# Altium schematic sheet 4_classyTKL_EC_analog.SchDoc: ClassyTKL - MX
size A4; Address1: github.com/4pplet/classytkl; Address2: Licence: CERN-OHL-S; Revision: A3; SheetNumber: 3; SheetTotal: 3
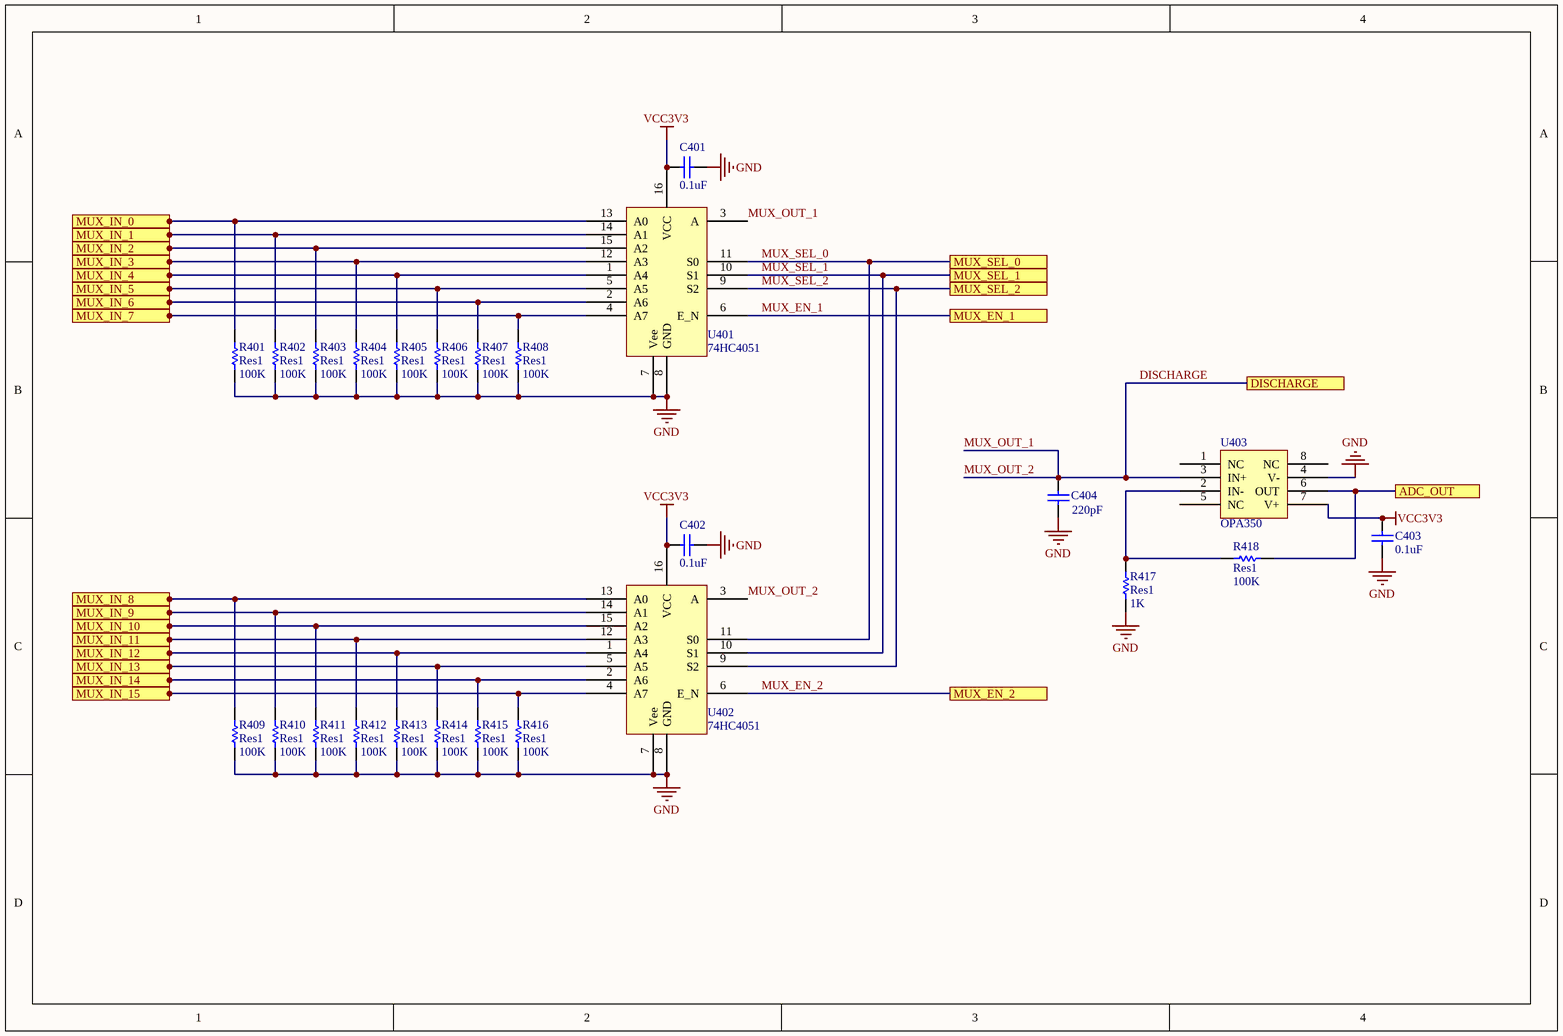
[diagram p0: 4_classyTKL_EC_analog.SchDoc]

## Parts
C401  value 0.1uF  [C0603[1608]]
C402  value 0.1uF  [C0603[1608]]
C403  value 0.1uF  [C0603[1608]]
C404  value 220pF  [C0603[1608]]
R401  Res1  value 100K  [R0603[1608]]
R402  Res1  value 100K  [R0603[1608]]
R403  Res1  value 100K  [R0603[1608]]
R404  Res1  value 100K  [R0603[1608]]
R405  Res1  value 100K  [R0603[1608]]
R406  Res1  value 100K  [R0603[1608]]
R407  Res1  value 100K  [R0603[1608]]
R408  Res1  value 100K  [R0603[1608]]
R409  Res1  value 100K  [R0603[1608]]
R410  Res1  value 100K  [R0603[1608]]
R411  Res1  value 100K  [R0603[1608]]
R412  Res1  value 100K  [R0603[1608]]
R413  Res1  value 100K  [R0603[1608]]
R414  Res1  value 100K  [R0603[1608]]
R415  Res1  value 100K  [R0603[1608]]
R416  Res1  value 100K  [R0603[1608]]
R417  Res1  value 1K  [R0603[1608]]
R418  Res1  value 100K  [R0603[1608]]
U401  74HC4051  [Texas_Instruments_D_SOIC16]
U402  74HC4051  [Texas_Instruments_D_SOIC16]
U403  OPA350  [SOIC-8]

## Ports
ADC_OUT, DISCHARGE, MUX_EN_1, MUX_EN_2, MUX_IN_0, MUX_IN_1, MUX_IN_2, MUX_IN_3, MUX_IN_4, MUX_IN_5, MUX_IN_6, MUX_IN_7, MUX_IN_8, MUX_IN_9, MUX_IN_10, MUX_IN_11, MUX_IN_12, MUX_IN_13, MUX_IN_14, MUX_IN_15, MUX_SEL_0, MUX_SEL_1, MUX_SEL_2

## Nets
GND: C401.1 C402.1 C403.2 C404.1 R401.2 R402.2 R403.2 R404.2 R405.2 R406.2 R407.2 R408.2 R409.2 R410.2 R411.2 R412.2 R413.2 R414.2 R415.2 R416.2 R417.2 U401.7(Vee) U401.8(GND) U402.7(Vee) U402.8(GND) U403.4(V-)
VCC3V3: C401.2 C402.2 C403.1 U401.16(VCC) U402.16(VCC) U403.7(V+)
ADC_OUT: R418.2 U403.6(OUT) ; port ADC_OUT
DISCHARGE: C404.2 U401.3(A) U402.3(A) U403.3(IN+) ; port DISCHARGE  [also labelled MUX_OUT_1, MUX_OUT_2]
MUX_EN_1: U401.6(E_N) ; port MUX_EN_1
MUX_EN_2: U402.6(E_N) ; port MUX_EN_2
MUX_IN_0: R401.1 U401.13(A0) ; port MUX_IN_0
MUX_IN_1: R402.1 U401.14(A1) ; port MUX_IN_1
MUX_IN_2: R403.1 U401.15(A2) ; port MUX_IN_2
MUX_IN_3: R404.1 U401.12(A3) ; port MUX_IN_3
MUX_IN_4: R405.1 U401.1(A4) ; port MUX_IN_4
MUX_IN_5: R406.1 U401.5(A5) ; port MUX_IN_5
MUX_IN_6: R407.1 U401.2(A6) ; port MUX_IN_6
MUX_IN_7: R408.1 U401.4(A7) ; port MUX_IN_7
MUX_IN_8: R409.1 U402.13(A0) ; port MUX_IN_8
MUX_IN_9: R410.1 U402.14(A1) ; port MUX_IN_9
MUX_IN_10: R411.1 U402.15(A2) ; port MUX_IN_10
MUX_IN_11: R412.1 U402.12(A3) ; port MUX_IN_11
MUX_IN_12: R413.1 U402.1(A4) ; port MUX_IN_12
MUX_IN_13: R414.1 U402.5(A5) ; port MUX_IN_13
MUX_IN_14: R415.1 U402.2(A6) ; port MUX_IN_14
MUX_IN_15: R416.1 U402.4(A7) ; port MUX_IN_15
MUX_SEL_0: U401.11(S0) U402.11(S0) ; port MUX_SEL_0
MUX_SEL_1: U401.10(S1) U402.10(S1) ; port MUX_SEL_1
MUX_SEL_2: U401.9(S2) U402.9(S2) ; port MUX_SEL_2
NetR417_1: R417.1 R418.1 U403.2(IN-)

Not connected (* = marked no-connect by the designer): U403 1(NC) 5(NC) 8(NC)

## Notes on the sheet
- Title
- Size:
- Date:
- A4
- Number:
- Time:
- Revision:
- Sheet
- of
- File:

## Library data of the parts
C401-C403 = Cap: Capacitor; MRF.Part: CC0603KRX7R9BB104; LCSC MFG: YAGEO; Version: 0603 imperial; LCSC Part #: C14663
C404 = Cap: Capacitor; MRF.Part: CL10B221KB8NNNC; LCSC MFG: Samsung Electro-Mechanics; Version: 0603 imperial; LCSC Part #: C1603
R401-R416 R418 = Res1: Resistor; MRF.Part: 0603WAF1003T5E; LCSC MFG: Uniroyal Elec; Version: 0603 imperial; LCSC Part #: C25803
R417 = Res1: Resistor; MRF.Part: 0603WAF1001T5E; LCSC MFG: UNI-ROYAL(Uniroyal Elec); Version: 0603 imperial; LCSC Part #: C21190
U401 U402 = 74HC4051: MRF.Part: 74HC4051D,653; LCSC MFG: Nexperia; LCSC Part #: C9386
U403 = OPA350: MRF.Part: OPA350UA/2K5; LCSC MFG: Texas Instruments; LCSC Part #: C13388